# EasyEDA Pro project ProPrj_TPS53318-大电流降压模块方案_2025-09-09_17-23-30_2025-09-09(1).epro

# Schematic TPS53318-大电流降压模块方案
Board Name: TPS53318-大电流降压模块方案; Create Date: 2025-09-09; Page Name: Sheet_1; Project Name: TPS53318-大电流降压模块方案_2025-09-09_17-23-30; Schematic Name: TPS53318-大电流降压模块方案; Update Date: 2025-09-09; Add into BOM: yes; Company: Your Company; Convert to PCB: yes; Date: 2020-05-10; Draw By: zhqsoft; REV: 1.0; Sheet: 1/1; spicePre: .
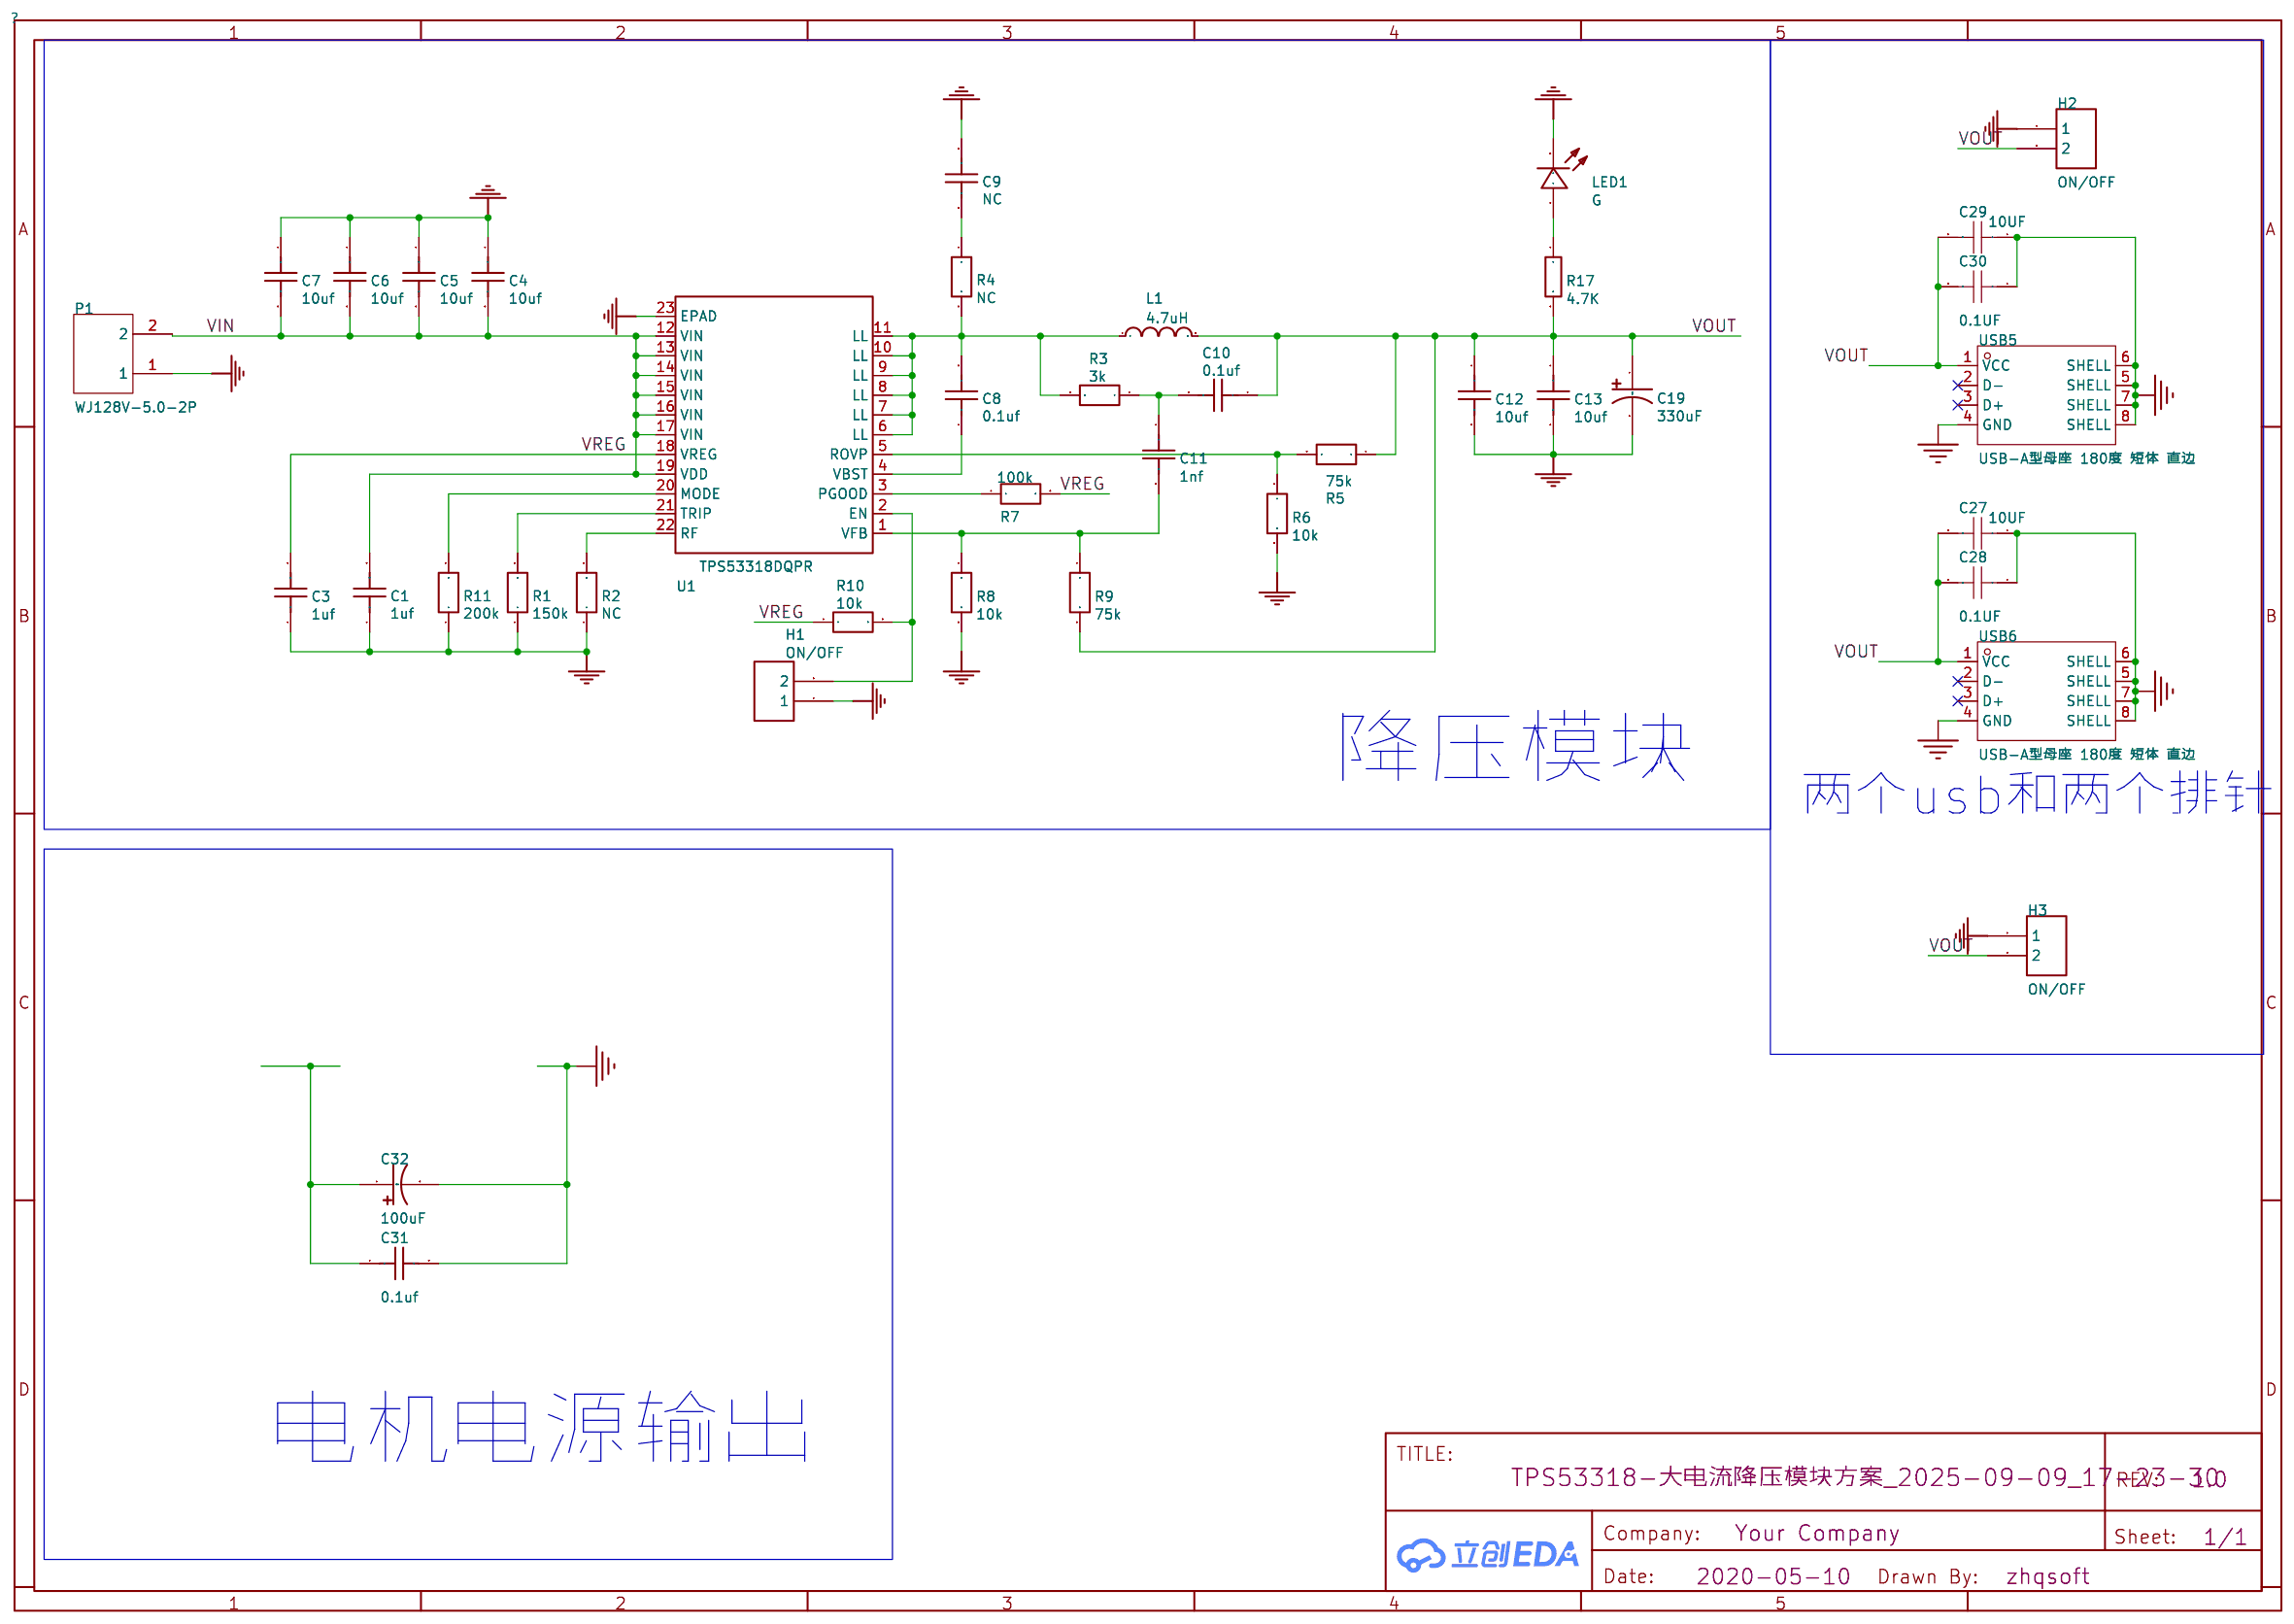
[diagram p0: schematic sheet]

## Parts
C1  1uf
C3  1uf
C4  10uf
C5  10uf
C6  10uf
C7  10uf
C8  0.1uf
C9  NC
C10  0.1uf
C11  1nf
C12  10uf
C13  10uf
C19  330uF
C27  10UF  [C0805]
C28  0.1UF  [C0805]
C29  10UF  [C0805]
C30  0.1UF  [C0805]
C31  0.1uf
C32  100uF
H1  ON/OFF
H2  ON/OFF
H3  ON/OFF
L1  4.7uH
LED1  G
P1  WJ128V-5.0-2P  [CONN-TH_2P-P5.00_WJ128V-5.0-2P]
R1  150k
R2  NC
R3  3k
R4  NC
R5  75k
R6  10k
R7  100k
R8  10k
R9  75k
R10  10k
R11  200k
R17  4.7K
U1  TPS53318DQPR
USB5  USB-A型母座 180度 短体 直边  [USB-A-SMD_WT_C9900004571]
USB6  USB-A型母座 180度 短体 直边  [USB-A-SMD_WT_C9900004571]

## Library data of the parts
C1 = 1uf: nameAlias: Value(F); Contributor: LCEDA_Lib; spicePre: C; spiceSymbolName: C_0805_US
C3 = 1uf: nameAlias: Value(F); Contributor: LCEDA_Lib; spicePre: C; spiceSymbolName: C_0402_US
C4-C7 C12 C13 C31 = 10uf: nameAlias: Value(F); Contributor: LCEDA_Lib; spicePre: C; spiceSymbolName: C_1206_US
C8 C10 = 0.1uf: nameAlias: Value(F); Contributor: LCEDA_Lib; spicePre: C; spiceSymbolName: C_0402_US
C9 = NC: nameAlias: Value(F); Contributor: LCEDA_Lib; spicePre: C; spiceSymbolName: C_0402_US
C11 = 1nf: nameAlias: Value(F); Contributor: LCEDA_Lib; spicePre: C; spiceSymbolName: C_0402_US
C19 C32 = 330uF: Supplier: LCSC; Manufacturer: LELON; Manufacturer Part: OVZ331M0JTR-0606; Supplier Part: C134881; JLCPCB Part Class: Extend; nameAlias: Capacitance; Contributor: LCSC; LCSC Assembly: Yes; spicePre: C; spiceSymbolName: OVZ331M0JTR-0606
C27-C30 = CAP_0805: Supplier Footprint: 0805
H1-H3 = ON/OFF: Supplier: LCSC; Manufacturer: TE Connectivity; Manufacturer Part: 3-644456-2; Supplier Part: C90288; spicePre: H; spiceSymbolName: 3-644456-2
L1 = 4.7uH: Supplier: LCSC; Manufacturer: SXN; Manufacturer Part: SMMS1040-4R7M; Supplier Part: C149593; nameAlias: Inductance; spicePre: L; spiceSymbolName: SMMS1040-4R7M
LED1 = G: Supplier: LCSC; Supplier Part: C205443; Manufacturer: Orient; Manufacturer Part: ORH-G36G; JLCPCB Part Class: Extend; Contributor: LCSC; LCSC Assembly: Yes; spicePre: L; spiceSymbolName: ORH-G36G
P1 = WJ128V-5.0-2P: 结构:1x2P;间距:5mm;颜色:绿色;安装方式:直插;额定电流:20A;额定电压:250V;排数:1;线规 - AWG:12~22;线规 - 平方毫米:2.5;每排PIN数:2;工作温度范围:-40℃~+105℃;; LCSC Part Name: 5mm 1x2P 排数:1 每排P数:2 直插; Supplier Part: C8269; Manufacturer: KANGNEX(康奈克斯电气); Supplier Footprint: 插件,P=5mm; JLCPCB Part Class: 扩展库; Datasheet: https://atta.szlcsc.com/upload/public/pdf/source/20191225/C8269_1FF44D6D2E83DB14A7CA266A410FD9AD.pdf; Supplier: LCSC; Structure: 1x2P; Pitch: 5mm; Color: 绿色; Mounting Style: 直插; Current Rating (Max): 20A; Voltage Rating (Max): 250V; Number of Pins: 2P; Number of Rows: 1; Wire Gauge - AWG: 12~22; Wire Gauge - mm2: 2.5; Number of PINs Per Row: 2; Operating Temperature Range: -40℃~+105℃
R1 = 150k: nameAlias: Value(Ω); Contributor: LCEDA_Lib; spicePre: R; spiceSymbolName: R_0402_EU
R2 R4 = NC: nameAlias: Value(Ω); Contributor: LCEDA_Lib; spicePre: R; spiceSymbolName: R_0402_EU
R3 = 3k: nameAlias: Value(Ω); Contributor: LCEDA_Lib; spicePre: R; spiceSymbolName: R_0402_EU
R5 R9 = 75k: nameAlias: Value(Ω); Contributor: LCEDA_Lib; spicePre: R; spiceSymbolName: R_0402_EU
R6 R8 R10 = 10k: nameAlias: Value(Ω); Contributor: LCEDA_Lib; spicePre: R; spiceSymbolName: R_0402_EU
R7 = 100k: nameAlias: Value(Ω); Contributor: LCEDA_Lib; spicePre: R; spiceSymbolName: R_0402_EU
R11 = 200k: nameAlias: Value(Ω); Contributor: LCEDA_Lib; spicePre: R; spiceSymbolName: R_0402_EU
R17 = 4.7K: Supplier: LCSC; Manufacturer: WALSIN; Manufacturer Part: WR04X4701FTL; Supplier Part: C163826; nameAlias: Resistance (Ohms); Contributor: LCSC; spicePre: R; spiceSymbolName: WR04X4701FTL
U1 = TPS53318DQPR: Supplier: LCSC; Supplier Part: C179745; Manufacturer: Texas Instruments; Contributor: LCSC; spicePre: U
USB5 USB6 = USB-A型母座 180度 短体 直边: Supplier Part: C9900004571; Supplier Footprint: SMD; JLCPCB Part Class: 扩展库; Supplier: LCSC

## Nets
GND: C1.1 C3.1 C4.1 C5.1 C6.1 C7.1 C9.2 C12.2 C13.2 C19.2 C27.1 C28.1 C29.1 C30.1 C31.2 C32.2 H1.1 H2.1 H3.1 LED1.2(K) P1.1 R1.1 R2.1 R6.2 R8.2 R11.1 U1.23(EPAD) USB5.4(GND) USB5.5(SHELL) USB5.6(SHELL) USB5.7(SHELL) USB5.8(SHELL) USB6.4(GND) USB6.5(SHELL) USB6.6(SHELL) USB6.7(SHELL) USB6.8(SHELL)
VIN: C1.2 C4.2 C5.2 C6.2 C7.2 P1.2 U1.12(VIN) U1.13(VIN) U1.14(VIN) U1.15(VIN) U1.16(VIN) U1.17(VIN) U1.19(VDD)
VOUT: C10.1 C12.1 C13.1 C19.1 C27.2 C28.2 C29.2 C30.2 H2.2 H3.2 L1.2 R5.1 R9.2 R17.2 USB5.1(VCC) USB6.1(VCC)
VREG: C3.2 R7.2 R10.1 U1.18(VREG)
Net-(C8-1): C8.1 U1.4(VBST)
Net-(C8-2): C8.2 L1.1 R3.2 R4.2 U1.6(LL) U1.7(LL) U1.8(LL) U1.9(LL) U1.10(LL) U1.11(LL)
Net-(C9-1): C9.1 R4.1
Net-(C10-2): C10.2 C11.1 R3.1
Net-(C11-2): C11.2 R8.1 R9.1 U1.1(VFB)
Net-(C31-1): C31.1 C32.1
Net-(H1-2): H1.2 R10.2 U1.2(EN)
Net-(LED1-1): LED1.1(A) R17.1
Net-(R1-2): R1.2 U1.21(TRIP)
Net-(R2-2): R2.2 U1.22(RF)
Net-(R5-2): R5.2 R6.1 U1.5(ROVP)
Net-(R7-1): R7.1 U1.3(PGOOD)
Net-(R11-2): R11.2 U1.20(MODE)

Not connected (* = marked no-connect by the designer): USB5 2(D-)* 3(D+)*; USB6 2(D-)* 3(D+)*

## Notes on the sheet
- 降压模块
- 两个usb和两个排针
- 电机电源输出
